# EAGLE schematic amp2 (EAGLE 7.7.0)

## Sheet 1 of 2
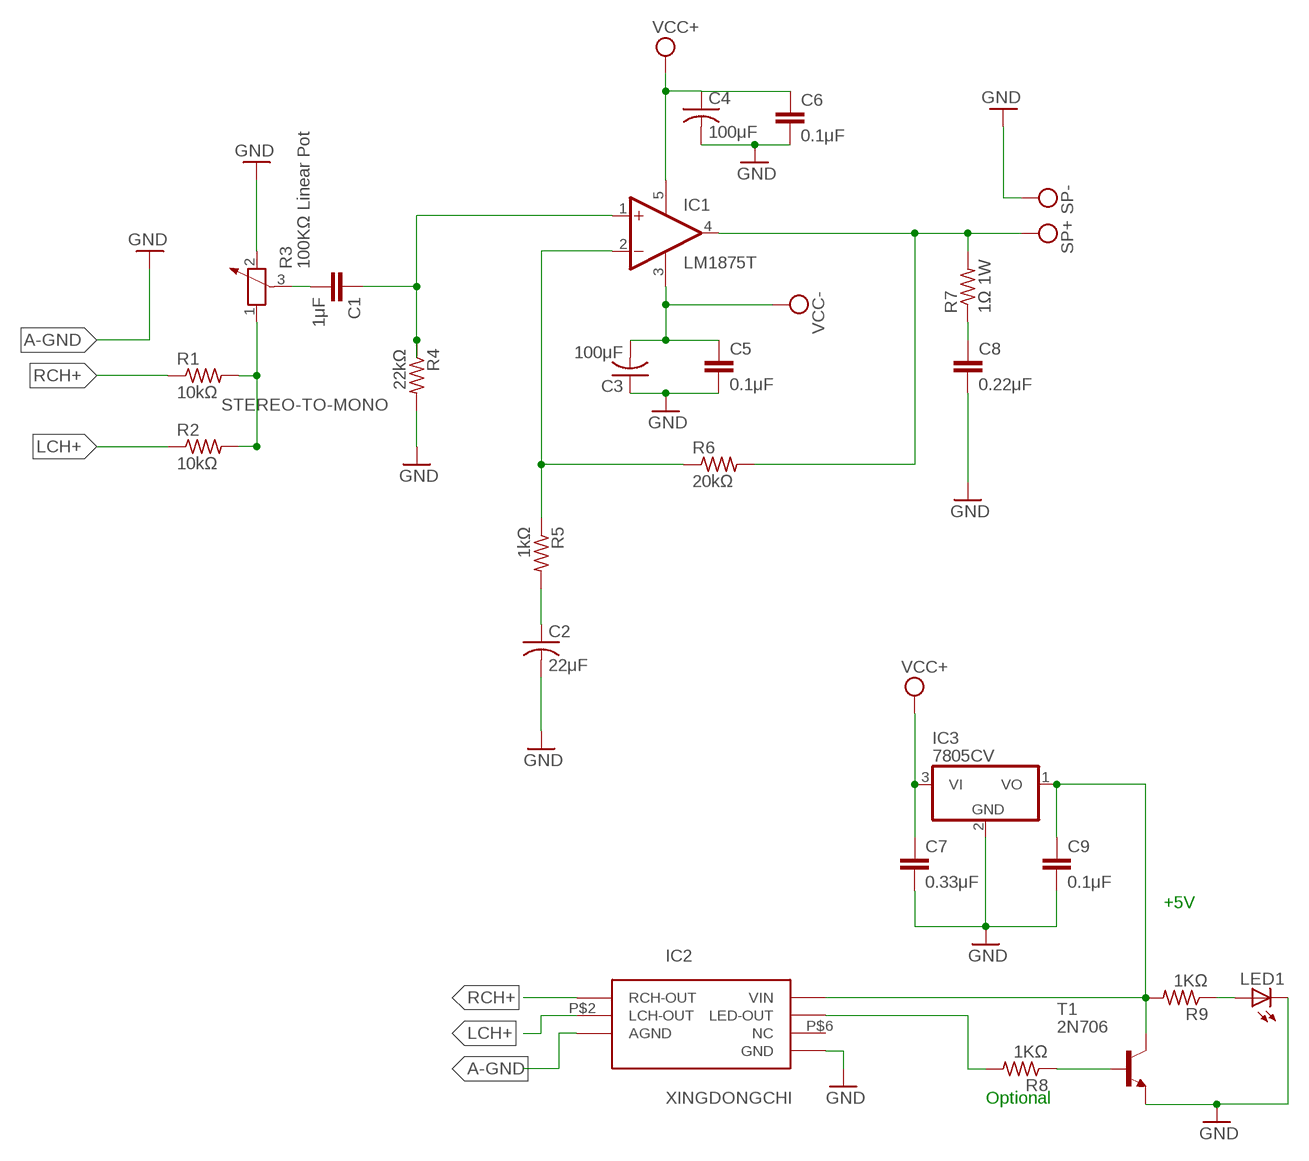
[diagram p0: schematic, sheet 1]

### Parts
C1  1μF  C-EU025-024X044  [C025-024X044]
C2  22μF  C-US025-024X044  [C025-024X044]
C3  100μF  C-US025-024X044  [C025-024X044]
C4  100μF  C-US025-024X044  [C025-024X044]
C5  0.1μF  C-EU025-024X044  [C025-024X044]
C6  0.1μF  C-EU025-024X044  [C025-024X044]
C7  0.33μF  C2,5-3  [C2.5-3]
C8  0.22μF  C-EU025-024X044  [C025-024X044]
C9  0.1μF  C2,5-3  [C2.5-3]
IC1  LM1875T  LM383T  [CB367]
IC2  XINGDONGCHI  [XINGDONGCHI-1]
IC3  7805CV  7805L  [TO92]
LED1  LED5MM  [LED5MM]
R1  10kΩ  R-US_0204/2V  [0204V]
R2  10kΩ  R-US_0204/2V  [0204V]
R3  100KΩ Linear Pot  POTENTIOMETER_PT-10  [PT-10]
R4  22kΩ  R-US_0204/2V  [0204V]
R5  1kΩ  R-US_0204/2V  [0204V]
R6  20kΩ  R-US_0204/2V  [0204V]
R7  1Ω 1W  R-US_0204/2V  [0204V]
R8  1KΩ  R-US_0204/2V  [0204V]
R9  1KΩ  R-US_0204/2V  [0204V]
T1  2N706  [TO18]

### Nets
A-GND: IC2.P$3(AGND) ; supply symbol labelled GND
GND: C7.2 C9.2 IC2.P$7(GND) IC3.2(GND) LED1.K(C) T1.1(E) ; also sheet 2
LCH+: IC2.P$2(LCH-OUT) R2.1
N$1: C2.1 R5.2
N$2: C1.1 IC1.1(+IN) R4.1
N$3: IC1.2(-IN) R5.1 R6.1
N$4: C1.2 R3.3
N$6: C8.1 R7.1
N$9: C9.1 IC2.P$4(VIN) IC3.1(VO) R9.2 T1.3(C)
N$10: R8.1 T1.2(B)
N$11: LED1.A R9.1
OPTIONAL1: IC2.P$5(LED-OUT) R8.2
RCH+: IC2.P$1(RCH-OUT) R1.1
RCH-GND: C2.2 C3.1 C4.2 C5.2 C6.2 C8.2 R3.2 R4.2 ; supply symbol labelled GND, SP-
STEREO-TO-MONO: R1.2 R2.2 R3.1
VCC: C3.2 C4.1 C5.1 C6.1 C7.1 IC1.3(GND) IC1.4(OUT) IC1.5(V+) IC3.3(VI) R6.2 R7.2 ; supply symbol labelled VCC-, VCC+, SP+ ; also sheet 2
Unconnected: IC2.P$6(NC)

### Notes on the sheet
- +5V
- Optional

## Sheet 2 of 2
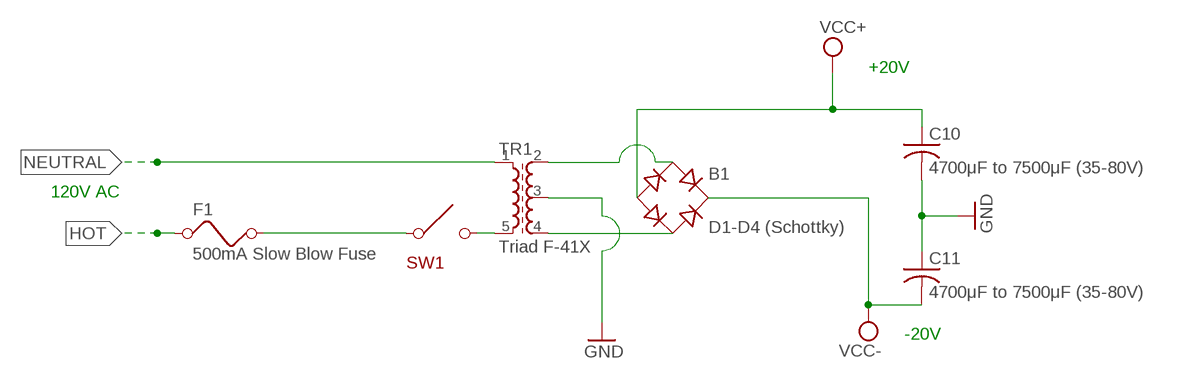
[diagram p1: schematic, sheet 2]

### Parts
B1  D1-D4 (Schottky)  DBDB101G  [DB]
C10  4700μF to 7500μF (35-80V)  C-US025-024X044  [C025-024X044]
C11  4700μF to 7500μF (35-80V)  C-US025-024X044  [C025-024X044]
F1  500mA Slow Blow Fuse  FUSE  [FUSE]
SW1  TOGGLESW  [TOGGLESW-1]
TR1  Triad F-41X  MS40A  [MS40]

### Nets
GND: C10.2 C11.1 TR1.3 ; also sheet 1
HOT: F1.1
N$5: B1.AC2 TR1.4
N$7: B1.AC1 TR1.2
N$12: SW1.P$2(P2) TR1.5
N$13: F1.2 SW1.P$1(P1)
NEUTRAL: TR1.1
VCC: B1.+ B1.- C10.1 C11.2 ; supply symbol labelled VCC+, VCC- ; also sheet 1

### Notes on the sheet
- +20V
- 120V AC
- -20V

## Library data of the parts
B1 = rectifier:DB?*G: Single Phase 1.0 AMP Glass Passivated Bridge Rectifier Taiwan Semiconductor Co.,Ltd. - TSC Source: http://www.taiwansemi.com/TSCbig5/ezcatfiles/cust/img/img/db101g.pdf http://www.ts.com.tw/db/pictures/modules/PDT/PDT060207001/DBLS201G.pdf
C1 C5 C6 C8 = rcl:C-EU: CAPACITOR, European symbol
C2-C4 = resistor:C-US: CAPACITOR, American symbol
C7 C9 = capacitor-wima:C: CAPACITOR naming: grid - package width
C10 C11 = rcl:C-US: CAPACITOR, American symbol
F1 = special:FUSE: FUSE 5 x 20 mm
IC1 = linear:LM383T: Power OP AMP
IC2 = Bluetooth:XINGDONGCHI: XINGDONGCHI-1
IC3 = linear:78*: Positive VOLTAGE REGULATOR Source: http://cache.national.com/ds/LM/LM78L05.pdf http://www.fairchildsemi.com/ds/LM/LM7805.pdf
LED1 = led:LED: LED OSRAM: - CHIPLED LG R971, LG N971, LY N971, LG Q971, LY Q971, LO R971, LY R971 LH N974, LH R974 LS Q976, LO Q976, LY Q976 LO Q996 - Hyper CHIPLED LW Q18S LB Q993, LB Q99A, LB R99A - SideLED LS A670, LO A670, LY A670, LG A670, LP A670 LB A673, LV A673, LT A673, LW A673 LH A674 LY A675 LS A676, LA A676, LO A676, LY A676, LW A676 LS A679, LY A679, LG A679 - Hyper Micro SIDELED® LS Y876, LA Y876, LO Y876, LY Y876 LT Y87S - SmartLED LW L88C, LW L88S LB L89C, LB L89S, LG L890 LS L89K, LO L89K, LY L89K LS L896, LA L896, LO L896, LY L896 - TOPLED LS T670, LO T670, LY T670, LG T670, LP T670 LSG T670, LSP T670, LSY T670, LOP T670, LYG T670 LG T671, LOG T671, LSG T671 LB T673, LV T673, LT T673, LW T673 LH T674 LS T676, LA T676, LO T676, LY T676, LB T676, LH T676, LSB T676, LW T676 LB T67C, LV T67C, LT T67C, LS T67K, LO T67K, LY T67K, LW E67C LS E67B, LA E67B, LO E67B, LY E67B, LB E67C, LV E67C, LT E67C LW T67C LS T679, LY T679, LG T679 LS T770, LO T770, LY T770, LG T770, LP T770 LB T773, LV T773, LT T773, LW T773 LH T774 LS E675, LA E675, LY E675, LS T675 LS T776, LA T776, LO T776, LY T776, LB T776 LHGB T686 LT T68C, LB T68C - Hyper Mini TOPLED® LB M676 - Mini TOPLED Santana® LG M470 LS M47K, LO M47K, LY M47K Source: http://www.osram.convergy.de LUXEON: - LUMILED® LXK2-PW12-R00, LXK2-PW12-S00, LXK2-PW14-U00, LXK2-PW14-V00 LXK2-PM12-R00, LXK2-PM12-S00, LXK2-PM14-U00 LXK2-PE12-Q00, LXK2-PE12-R00, LXK2-PE12-S00, LXK2-PE14-T00, LXK2-PE14-U00 LXK2-PB12-K00, LXK2-PB12-L00, LXK2-PB12-M00, LXK2-PB14-N00, LXK2-PB14-P00, LXK2-PB14-Q00 LXK2-PR12-L00, LXK2-PR12-M00, LXK2-PR14-Q00, LXK2-PR14-R00 LXK2-PD12-Q00, LXK2-PD12-R00, LXK2-PD12-S00 LXK2-PH12-R00, LXK2-PH12-S00 LXK2-PL12-P00, LXK2-PL12-Q00, LXK2-PL12-R00 Source: www.luxeon.com KINGBRIGHT: KA-3528ASYC Source: www.kingbright.com
R1 R2 R4-R9 = resistor:R-US_: RESISTOR, American symbol
R3 = rcl:POTENTIOMETER_: Potentiometer
SW1 = Bluetooth:TOGGLESW
T1 = transistor:2N706: NPN TRANSISTOR
TR1 = inductor-neosid:MS40: TRANSFORMER SMD transformer acc. to customer specification; OC_FARNELL: unknown; OC_NEWARK: unknown